# EAGLE design rpi_can (EAGLE 6.6.0)
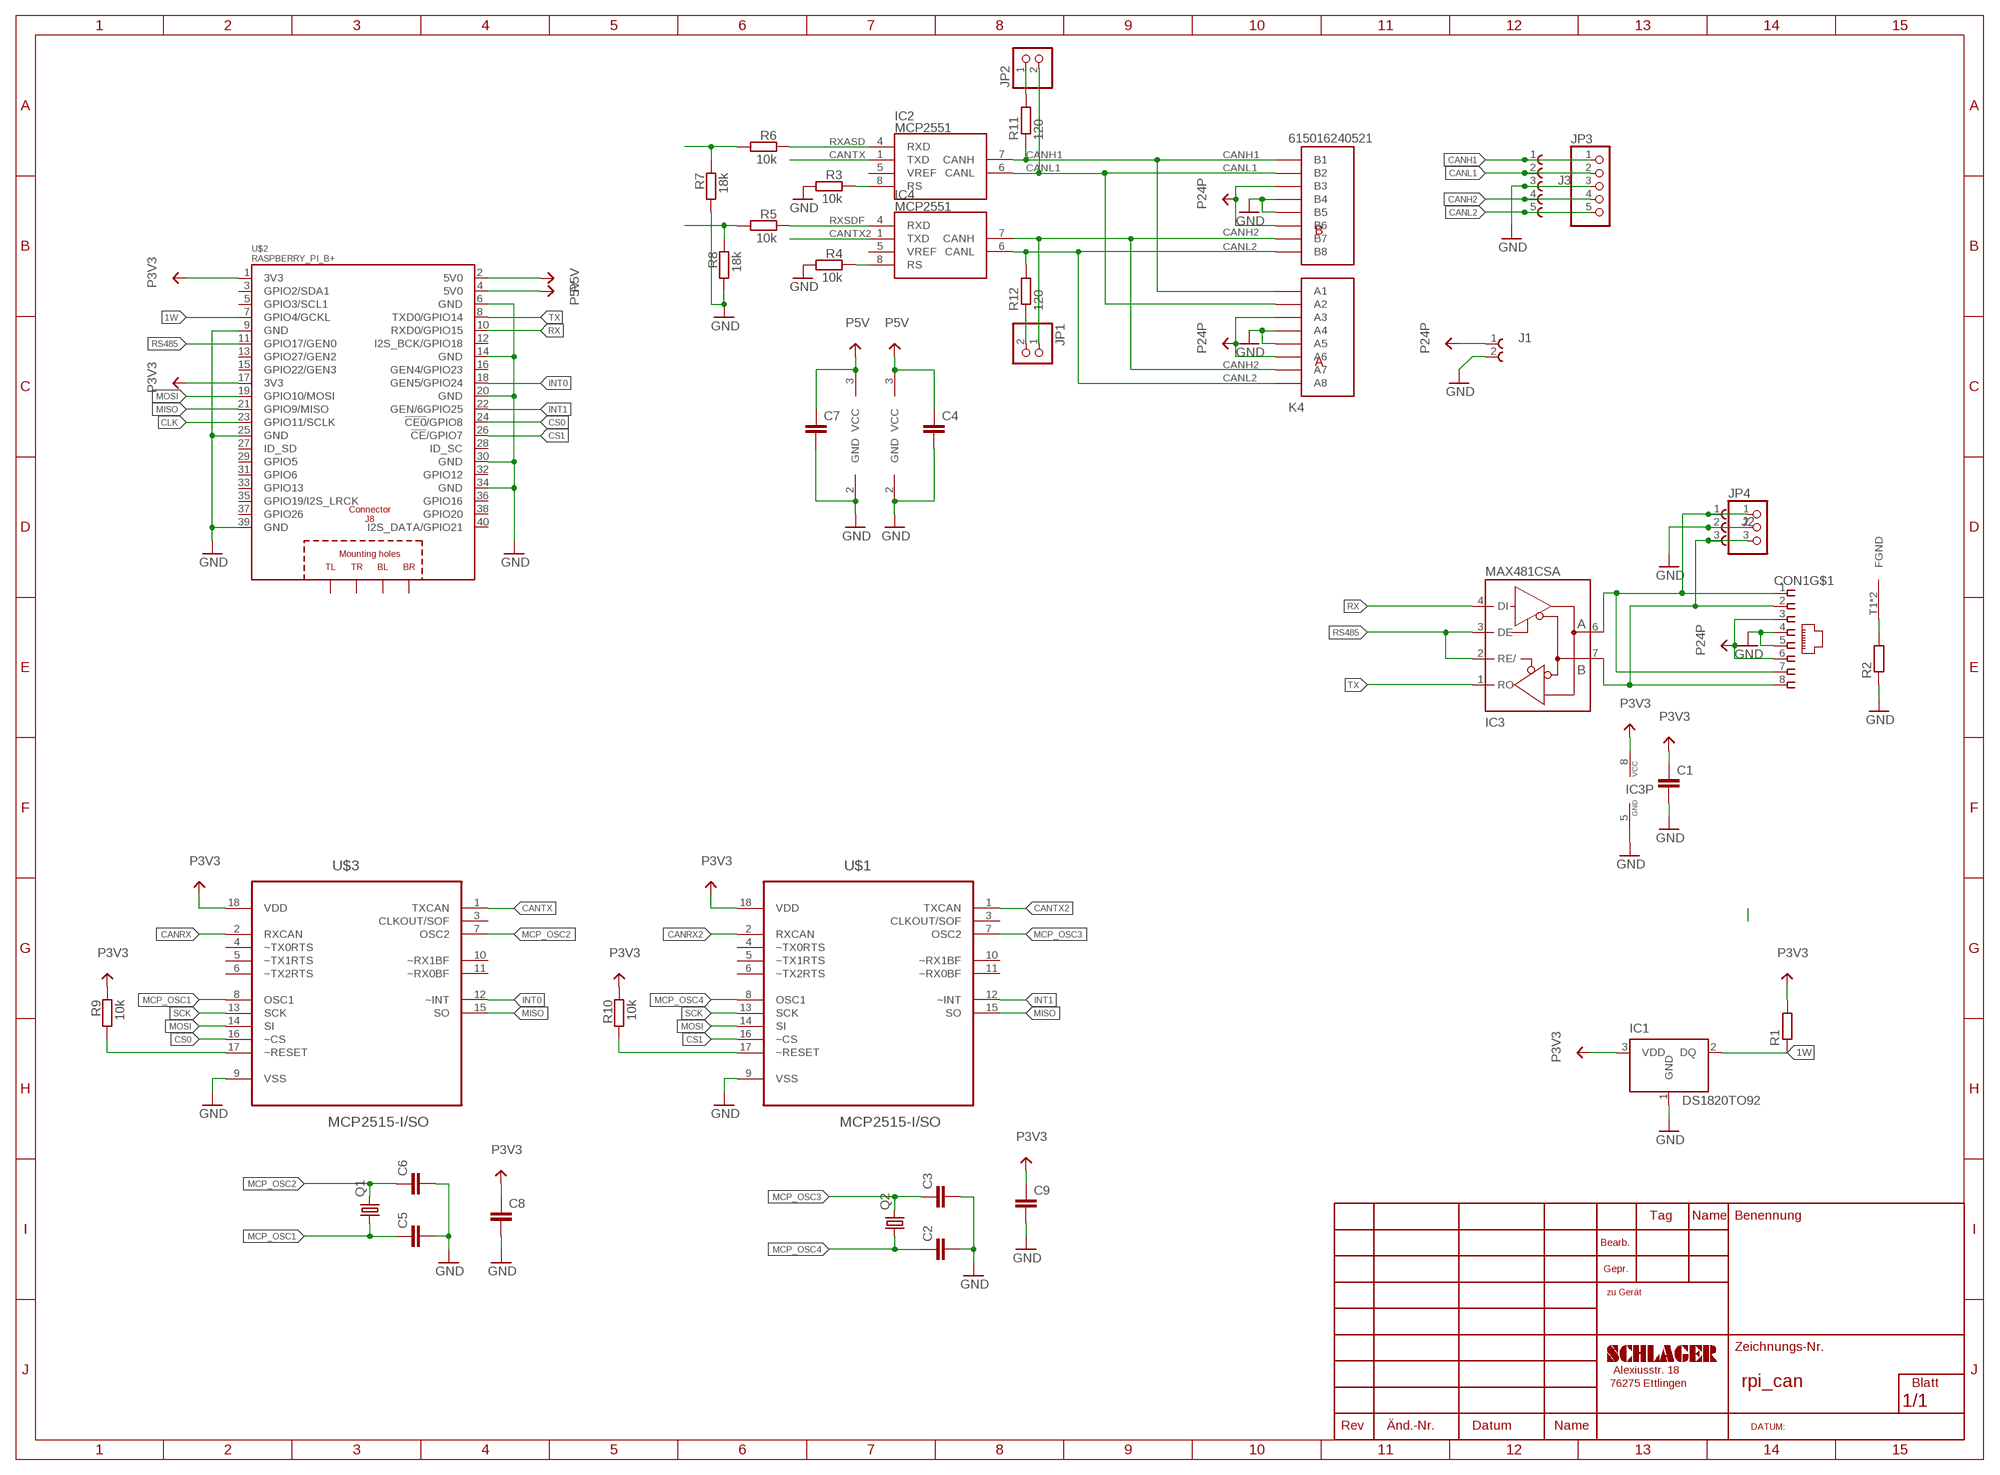
[diagram p0: schematic, sheet 1]

## Parts
C1  C-EUC0805  [C0805]
C2  C-EUC0805  [C0805]
C3  C-EUC0805  [C0805]
C4  C-EUC0805  [C0805]
C5  C-EUC0805  [C0805]
C6  C-EUC0805  [C0805]
C7  C-EUC0805  [C0805]
C8  C-EUC0805  [C0805]
C9  C-EUC0805  [C0805]
CON1  MEBP_8-8G  [MEBP]
IC1  DS1820TO92  [TO-92]
IC2  MCP2551  [SO-8]
IC3  MAX481CSA  [SO08]
IC4  MCP2551  [SO-8]
J1  691322310002  [691322310002]
J2  691322310003  [691322310003]
J3  691322310005  [691322310005]
JP1  PINHD-1X2  [1X02]
JP2  PINHD-1X2  [1X02]
JP3  PINHD-1X5  [1X05]
JP4  PINHD-1X3  [1X03]
K4  615016240521  [615016240521]
Q1  CRYSTALHC49S  [HC49/S]
Q2  CRYSTALHC49S  [HC49/S]
R1  R-EU_R0805  [R0805]
R2  R-EU_R0805  [R0805]
R3  10k  R-EU_R0805  [R0805]
R4  10k  R-EU_R0805  [R0805]
R5  10k  R-EU_R0805  [R0805]
R6  10k  R-EU_R0805  [R0805]
R7  18k  R-EU_R0805  [R0805]
R8  18k  R-EU_R0805  [R0805]
R9  10k  R-EU_R0805  [R0805]
R10  10k  R-EU_R0805  [R0805]
R11  120  R-EU_R0805  [R0805]
R12  120  R-EU_R0805  [R0805]
U$1  MCP2515-I/SO  [SOIC127P1034X264-18N]
U$2  RASPBERRY_PI_B+  [RASPBERRY_PI_B+]
U$3  MCP2515-I/SO  [SOIC127P1034X264-18N]

## Nets
1W: IC1.2(DQ) R1.1 U$2.7(GPIO4/GCKL)
CANH1: IC2.7(CANH) J3.1 JP3.1 K4.A1 K4.B1 R11.1
CANH2: IC4.7(CANH) J3.4 JP1.1 JP3.4 K4.A7 K4.B7
CANL1: IC2.6(CANL) J3.2 JP2.2 JP3.2 K4.A2 K4.B2
CANL2: IC4.6(CANL) J3.5 JP3.5 K4.A8 K4.B8 R12.2
CANRX: R6.2 R7.1 U$3.2(RXCAN)
CANRX2: R5.2 R8.1 U$1.2(RXCAN)
CANTX: IC2.1(TXD) U$3.1(TXCAN)
CANTX2: IC4.1(TXD) U$1.1(TXCAN)
CLK: U$2.23(GPIO11/SCLK)
CS0: U$2.24(!CE0!/GPIO8) U$3.16(~CS)
CS1: U$1.16(~CS) U$2.26(!CE!/GPIO7)
GND: C1.2 C2.2 C3.2 C4.2 C5.2 C6.2 C7.2 C8.2 C9.2 CON1.4 CON1.5 IC1.1(GND) IC2.2(GND) IC3.5(GND) IC4.2(GND) J1.2 J2.2 J3.3 JP3.3 JP4.2 K4.A4 K4.A5 K4.B4 K4.B5 R2.1 R3.2 R4.2 R7.2 R8.2 U$1.9(VSS) U$2.6(GND) U$2.9(GND) U$2.14(GND) U$2.20(GND) U$2.25(GND) U$2.30(GND) U$2.34(GND) U$2.39(GND) U$3.9(VSS)
INT0: U$2.18(GEN5/GPIO24) U$3.12(~INT)
INT1: U$1.12(~INT) U$2.22(GEN/6GPIO25)
MCP_OSC1: C5.1 Q1.1 U$3.8(OSC1)
MCP_OSC2: C6.1 Q1.2 U$3.7(OSC2)
MCP_OSC3: C3.1 Q2.2 U$1.7(OSC2)
MCP_OSC4: C2.1 Q2.1 U$1.8(OSC1)
MISO: U$1.15(SO) U$2.21(GPIO9/MISO) U$3.15(SO)
MOSI: U$1.14(SI) U$2.19(GPIO10/MOSI) U$3.14(SI)
N$1: R10.2 U$1.17(~RESET)
N$2: IC2.8(RS) R3.1
N$3: CON1.T1(FGND) CON1.T2(FGND) R2.2
N$4: IC4.8(RS) R4.1
N$5: R9.2 U$3.17(~RESET)
N$6: JP2.1 R11.2
N$7: JP1.2 R12.1
P3V3: C1.1 C8.1 C9.1 IC1.3(VDD) IC3.8(VCC) R1.2 R9.1 R10.1 U$1.18(VDD) U$2.1(3V3) U$2.17(3V3) U$3.18(VDD)
P5V: C4.1 C7.1 IC2.3(VCC) IC4.3(VCC) U$2.2(5V0) U$2.4(5V0)
P24P: CON1.3 CON1.6 J1.1 K4.A3 K4.A6 K4.B3 K4.B6
RS485: IC3.2(RE/) IC3.3(DE) U$2.11(GPIO17/GEN0)
RS485_A: CON1.1 CON1.7 IC3.6(A) J2.1 JP4.1
RS485_B: CON1.2 CON1.8 IC3.7(B) J2.3 JP4.3
RX: IC3.4(DI) U$2.10(RXD0/GPIO15)
RXASD: IC2.4(RXD) R6.1
RXSDF: IC4.4(RXD) R5.1
SCK: U$1.13(SCK) U$3.13(SCK)
TX: IC3.1(RO) U$2.8(TXD0/GPIO14)
Unconnected: IC2.5(VREF) IC4.5(VREF) U$1.3(CLKOUT/SOF) U$1.4(~TX0RTS) U$1.5(~TX1RTS) U$1.6(~TX2RTS) U$1.10(~RX1BF) U$1.11(~RX0BF) U$2.3(GPIO2/SDA1) U$2.5(GPIO3/SCL1) U$2.12(I2S_BCK/GPIO18) U$2.13(GPIO27/GEN2) U$2.15(GPIO22/GEN3) U$2.16(GEN4/GPIO23) U$2.27(ID_SD) U$2.28(ID_SC) U$2.29(GPIO5) U$2.31(GPIO6) U$2.32(GPIO12) U$2.33(GPIO13) U$2.35(GPIO19/I2S_LRCK) U$2.36(GPIO16) U$2.37(GPIO26) U$2.38(GPIO20) U$2.40(I2S_DATA/GPIO21) U$2.PE_BL(BL) U$2.PE_BR(BR) U$2.PE_TL(TL) U$2.PE_TR(TR) U$3.3(CLKOUT/SOF) U$3.4(~TX0RTS) U$3.5(~TX1RTS) U$3.6(~TX2RTS) U$3.10(~RX1BF) U$3.11(~RX0BF)

## Library data of the parts
C1-C9 = schlager_passiv:C-EU: CAPACITOR, European symbol
CON1 = myconn:MEBP_8-8G: Reichelt RJ45 geschirmt MEBP 8-8G
IC1 = schlager_ics:DS1820: DS1820 - 1-Wire Digital Thermometer
IC2 IC4 = MYMCHIP:MCP2551: CAN Transceiver
IC3 = maxim:MAX481CSA: RS485 TRANSEIVER; MF: MAXIM; MPN: MAX481CSA; OC_FARNELL: unknown; OC_NEWARK: 90C3817
J1 = Eagle_TERMINAL_BLOCKS_rev16a:691322310002: WR-TBL Serie 322 - 3.81mm Vertical PCB Header , 2 Pins=>Code : Con_TBL_Pluggable_3.81_PCB_THT_Simple_691322310002 <http://katalog.we-online.de/media/images/eican/Con_TBL_Pluggable_3.81_PCB_THT_Simple_6913223100xx_pf2.jpg> Details see: http://katalog.we-online.de/en/em/691_322_310_0xx Created 2014-06-19, Karrer Zheng 2014 (C) Würth Elektronik
J2 = Wuerth_TERMINAL_BLOCKS_rev16a:691322310003: WR-TBL Serie 322 - 3.81mm Vertical PCB Header , 3 Pins=>Code : Con_TBL_Pluggable_3.81_PCB_THT_Simple_691322310003 <http://katalog.we-online.de/media/images/eican/Con_TBL_Pluggable_3.81_PCB_THT_Simple_6913223100xx_pf2.jpg> Details see: http://katalog.we-online.de/en/em/691_322_310_0xx Created 2014-06-19, Karrer Zheng 2014 (C) Würth Elektronik
J3 = Eagle_TERMINAL_BLOCKS_rev16a:691322310005: WR-TBL Serie 322 - 3.81mm Vertical PCB Header , 5 Pins=>Code : Con_TBL_Pluggable_3.81_PCB_THT_Simple_691322310005 <http://katalog.we-online.de/media/images/eican/Con_TBL_Pluggable_3.81_PCB_THT_Simple_6913223100xx_pf2.jpg> Details see: http://katalog.we-online.de/en/em/691_322_310_0xx Created 2014-06-19, Karrer Zheng 2014 (C) Würth Elektronik
JP1 JP2 = pinhead:PINHD-1X2: PIN HEADER
JP3 = pinhead:PINHD-1X5: PIN HEADER
JP4 = pinhead:PINHD-1X3: PIN HEADER
K4 = Wuerth_Elektronik_eiCan_Communication_Connectors:615016240521: WR-MJ Horizontal Shielded Dual Stacked Port with EMI Panel Finger 8P8C Modular Jack Tab Up & Down, 16 Pins
Q1 Q2 = crystal:CRYSTAL: CRYSTAL; OC_FARNELL: 1667008; OC_NEWARK: unknown
R1-R12 = schlager_passiv:R-EU_: RESISTOR, European symbol
U$1 U$3 = schlager_ics:MCP2515-I/SO: CAN Controller; MPN: MCP2515-I/SO; OC_FARNELL: 1292239; OC_NEWARK: 29H7136; PACKAGE: SOIC-18; SUPPLIER: Microchip
U$2 = debauer_modules:RASPBERRY_PI_B+

## Net classes
4 USBpair: width 0.254 mm, drill 0.406 mm, clearance 0.508 mm

## Board
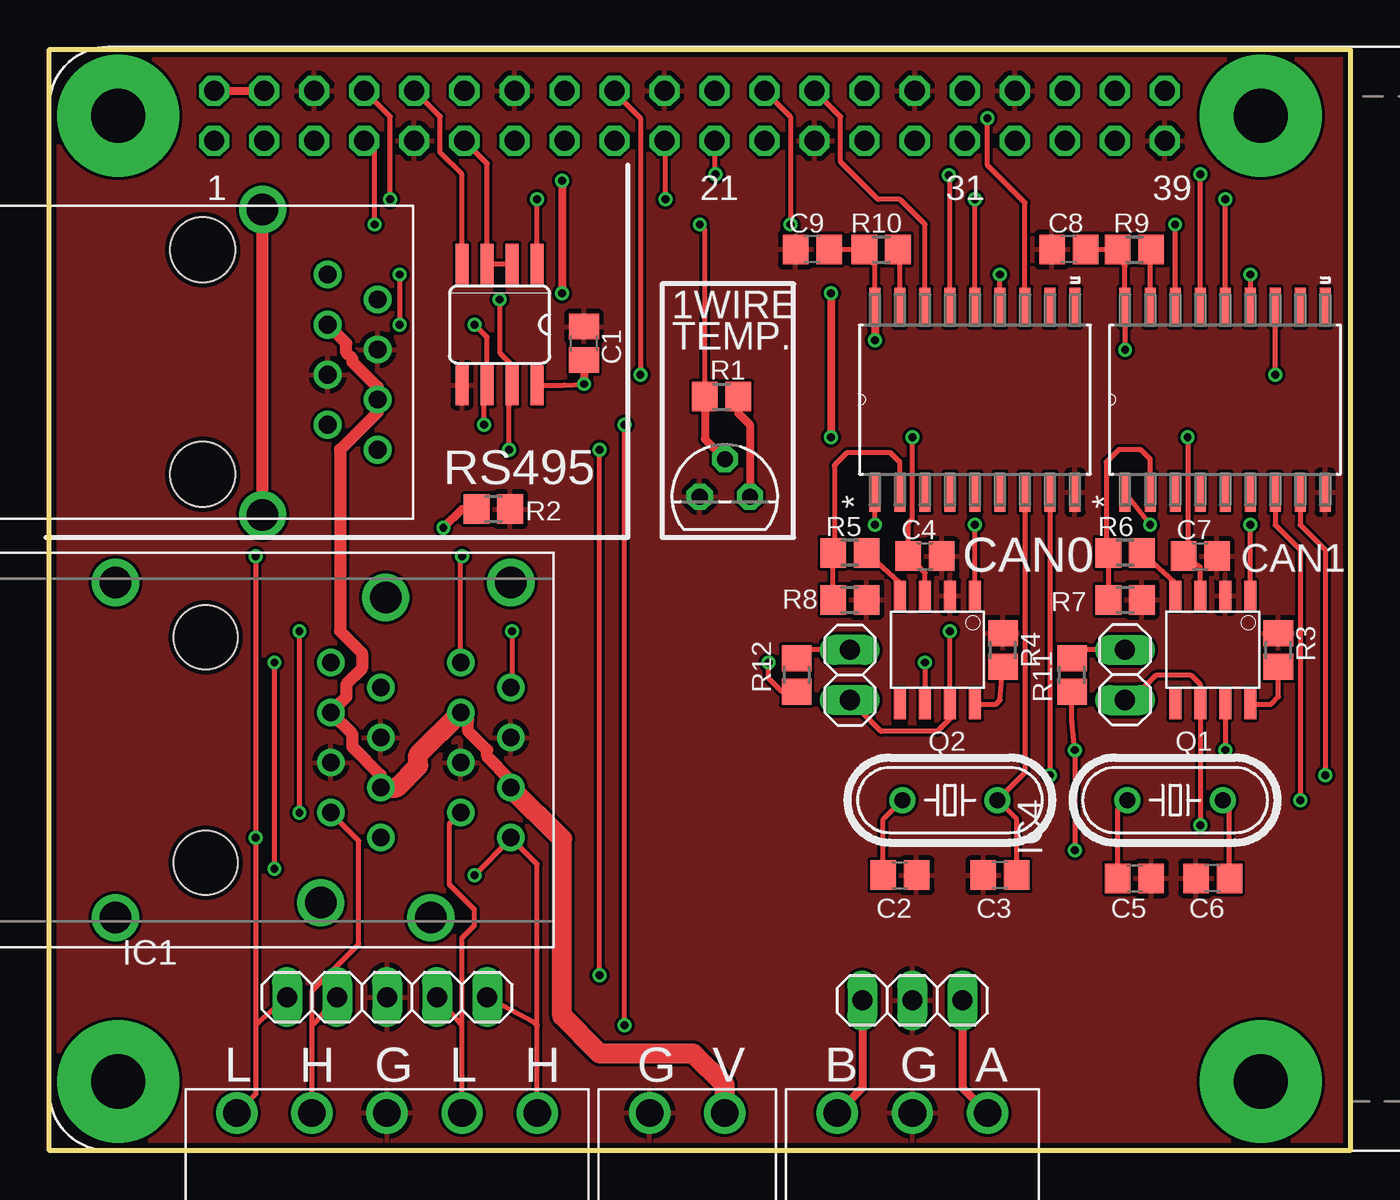
[diagram p1: board, top side]
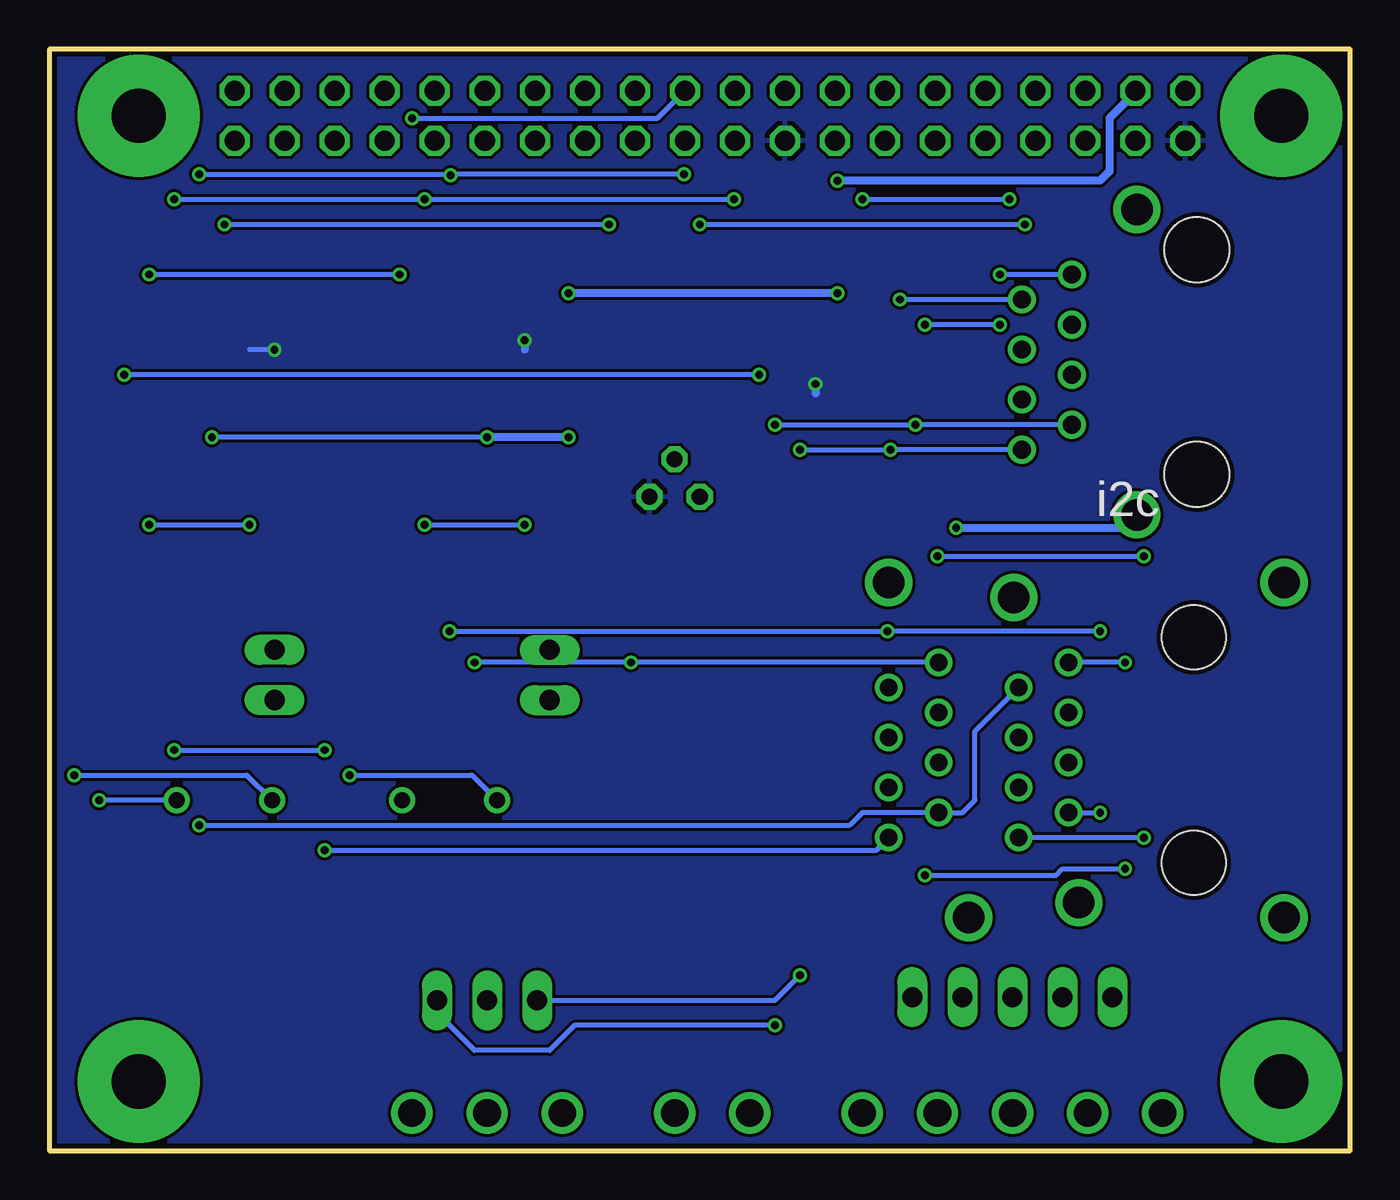
[diagram p2: board, bottom side, seen from below]

Size 66.04 x 55.88 mm. Coordinates in mm from the lower left corner, seen from the top.
Outline: 0,0 0,55.88 66.04,55.88 66.04,0 0,0
Copper layers (1*16): Top 0.035mm / dielectric 1.5mm / Bottom 0.035mm
Design rules "ITEADstudio_DRC": minimum track width 6mil, minimum drill 12mil, track to track 6mil, track to pad 6mil, pad to pad 6mil, via to via 6mil, smd to smd 0mil, copper to edge 10mil, drill to drill 10mil, minimum pad ring 10mil, minimum via ring 6mil, stop-mask expansion 2mil, vias tented up to drill 100mil, thermal gap 10mil

### Footprints (pad centres in the part's own frame; a part is rotated, then mirrored left to right if it is on the bottom)
C0805 = smd 1.3 x 1.5: 1 -0.85,0; 2 0.85,0
MEBP = drill 0.9: 1 -4.445,6.35; 2 -3.175,8.89; 3 -1.9,6.35; 4 -0.635,8.89; 5 0.635,6.35; 6 1.9,8.89; 7 3.175,6.35; 8 4.445,8.89 | drill 1.6: T1 -7.75,3.05; T2 7.75,3.05 | hole 3.3: -5.7,0; 5.7,0
TO-92 = drill 0.813 pad 1.27 octagon: 1 -1.27,0; 2 0,1.905; 3 1.27,0
SO-8 = smd 0.61 x 1.524: 1 0,-0.203; 2 1.27,-0.203; 3 2.54,-0.203; 4 3.81,-0.203; 5 3.81,5.283; 6 2.54,5.283; 7 1.27,5.283; 8 0,5.283
SO08 = smd 0.66 x 2.032: 1 -1.905,-3.073; 2 -0.635,-3.073; 3 0.635,-3.073; 4 1.905,-3.073; 5 1.905,3.073; 6 0.635,3.073; 7 -0.635,3.073; 8 -1.905,3.073
691322310002 = drill 1.4: 1 -3.81,0; 2 0,0
691322310003 = drill 1.4: 1 -3.81,0; 2 0,0; 3 3.81,0
691322310005 = drill 1.4: 1 -3.81,0; 2 0,0; 3 3.81,0; 4 7.62,0; 5 11.43,0
1X02 = drill 1.016 long: 1 -1.27,0; 2 1.27,0
1X05 = drill 1.016 long: 1 -5.08,0; 2 -2.54,0; 3 0,0; 4 2.54,0; 5 5.08,0
1X03 = drill 1.016 long: 1 -2.54,0; 2 0,0; 3 2.54,0
615016240521 = drill 0.89: A1 -4.445,-1.27; A2 -3.175,1.27; A3 -1.905,-1.27; A4 -0.635,1.27; A5 0.635,-1.27; A6 1.905,1.27; A7 3.175,-1.27; A8 4.445,1.27; B1 4.445,7.87; B2 3.175,5.33; B3 1.905,7.87; B4 0.635,5.33; B5 -0.635,7.87; B6 -1.905,5.33; B7 -3.175,7.87; B8 -4.445,5.33 | drill 1.6: Z1 -8.505,-12.19; Z2 8.505,-12.19; Z3 7.745,-1.78; Z4 -7.745,1.52; Z5 8.505,3.81; Z6 -8.505,7.87 | hole 3.25: -5.715,-7.62; 5.715,-7.62
HC49/S = drill 0.813: 1 -2.413,0; 2 2.413,0
R0805 = smd 1.3 x 1.5: 1 -0.85,0; 2 0.85,0
SOIC127P1034X264-18N = smd 1.981 x 0.559: 1 -4.699,5.08; 2 -4.699,3.81; 3 -4.699,2.54; 4 -4.699,1.27; 5 -4.699,0; 6 -4.699,-1.27; 7 -4.699,-2.54; 8 -4.699,-3.81; 9 -4.699,-5.08; 10 4.699,-5.08; 11 4.699,-3.81; 12 4.699,-2.54; 13 4.699,-1.27; 14 4.699,0; 15 4.699,1.27; 16 4.699,2.54; 17 4.699,3.81; 18 4.699,5.08
RASPBERRY_PI_B+ = drill 1.016 octagon: 1 8.37,51.23; 2 8.37,53.77; 3 10.91,51.23; 4 10.91,53.77; 5 13.45,51.23; 6 13.45,53.77; 7 15.99,51.23; 8 15.99,53.77; 9 18.53,51.23; 10 18.53,53.77; 11 21.07,51.23; 12 21.07,53.77; 13 23.61,51.23; 14 23.61,53.77; 15 26.15,51.23; 16 26.15,53.77; 17 28.69,51.23; 18 28.69,53.77; 19 31.23,51.23; 20 31.23,53.77; 21 33.77,51.23; 22 33.77,53.77; 23 36.31,51.23; 24 36.31,53.77; 25 38.85,51.23; 26 38.85,53.77; 27 41.39,51.23; 28 41.39,53.77; 29 43.93,51.23; 30 43.93,53.77; 31 46.47,51.23; 32 46.47,53.77; 33 49.01,51.23; 34 49.01,53.77; 35 51.55,51.23; 36 51.55,53.77; 37 54.09,51.23; 38 54.09,53.77; 39 56.63,51.23; 40 56.63,53.77 | drill 2.75 pad 6.2: PE_BL 3.5,3.5; PE_BR 61.5,3.5; PE_TL 3.5,52.5; PE_TR 61.5,52.5

### Placement (x,y rotation side)
C1  27.15,40.96 90 top
C2  43.18,13.97 0 top
C3  48.26,13.97 180 top
C4  44.45,30.16 0 top
C5  55.09,13.81 0 top
C6  59.05,13.81 180 top
C7  58.42,30.16 0 top
C8  51.75,45.72 180 top
C9  38.73,45.72 180 top
CON1  7.78,40.01 270 top
IC1  34.29,33.18 0 top
IC2  60.96,27.94 180 top
IC3  22.86,41.91 180 top
IC4  46.99,27.94 180 top
J1  30.48,1.91 180 top
J2  43.81,1.91 180 top
J3  20.95,1.91 180 top
JP1  40.64,24.13 90 top
JP2  54.61,24.13 270 top
JP3  17.14,7.78 180 top
JP4  43.81,7.62 180 top
K4  15.56,20.32 270 top
Q1  57.15,17.78 0 top
Q2  45.72,17.78 0 top
R1  34.13,38.26 0 top
R2  22.54,32.54 180 top
R3  62.39,25.4 90 top
R4  48.42,25.4 90 top
R5  40.64,30.32 180 top
R6  54.61,30.32 180 top
R7  54.61,27.94 0 top
R8  40.64,27.94 0 top
R9  55.09,45.72 0 top
R10  42.23,45.72 0 top
R11  51.91,24.13 90 top
R12  37.94,24.13 270 top
U$1  46.99,38.1 90 top
U$2  0,0 0 top
U$3  59.69,38.1 90 top

### Tracks (layer width: path | path; a pad name or v marks a point on that pad's centre or on a via)
1W  (via drill 0.4)
  Top 0.254: R1.1 33.28,46.73 v33.02,46.99 | v16.51,46.99 16.51,50.71 U$2.7
  Top 0.406: R1.1 33.28,36.09 IC1.2
  Bottom 0.254: v33.02,46.99 v16.51,46.99
CANH1  (via drill 0.4)
  Top 0.254: v21.59,13.97 23.43,15.81 K4.B1 24.77,14.54 24.77,6.35 | v11.43,14.29 v11.43,24.77 | IC2.7 v59.69,20.32 | v52.07,15.24 v52.07,20.32 51.91,21.75 R11.1 | J3.1 24.77,6.35 | JP3.1 24.61,6.51 24.77,6.35
  Bottom 0.254: v21.59,13.97 14.92,13.97 14.61,14.29 v11.43,14.29 | v11.43,24.77 K4.A1 | v59.69,20.32 v52.07,20.32 | v52.07,15.24 24.06,15.24 K4.B1
CANH2  (via drill 0.4)
  Top 0.254: v12.7,17.14 v12.7,26.35 | v23.5,26.35 23.5,23.56 K4.B7 | v45.72,26.35 IC4.7 45.72,21.91 45.09,21.27 42.23,21.27 JP1.1 | J3.4 13.34,6.35 | 13.34,6.35 13.34,8.1 15.72,10.48 15.72,15.72 K4.A7 | JP3.4 13.49,6.51 13.34,6.35
  Bottom 0.254: K4.A7 v12.7,17.14 | v12.7,26.35 v23.5,26.35 v45.72,26.35
CANL1  (via drill 0.4)
  Top 0.254: v58.42,16.51 IC2.6 58.42,23.65 57.94,24.13 56.2,24.13 54.93,22.86 JP2.2 | J3.2 20.95,6.35 | 20.95,6.35 20.95,10.79 21.59,11.43 21.59,12.22 20.32,13.49 20.32,16.58 K4.B2 | JP3.2 20.8,6.51 20.95,6.35
  Bottom 0.254: K4.A2 19.05,21.27 19.05,17.78 19.68,17.14 K4.B2 24.77,17.14 25.4,16.51 v58.42,16.51
CANL2  (via drill 0.4)
  Top 0.254: K4.B8 20.89,30.09 v20.95,30.16 | v10.48,30.16 v10.48,15.88 10.48,6.35 | v44.45,24.77 IC4.6 | 10.48,6.35 10.48,2.86 J3.5 | JP3.5 10.64,6.51 10.48,6.35 | R12.2 37.2,23.28 36.51,23.97 v36.51,24.77
  Bottom 0.254: v20.95,30.16 v10.48,30.16 | v10.48,15.88 K4.A8 | K4.B8 v36.51,24.77 v44.45,24.77
CANRX
  Top 0.254: U$3.2 55.88,35.08 55.4,35.56 54.29,35.56 53.66,34.92 53.66,30.58 R6.2 R7.1
CANRX2
  Top 0.254: R8.1 R5.2 39.85,30.54 39.85,34.77 40.48,35.4 42.7,35.4 43.18,34.92 U$1.2
CANTX  (via drill 0.4)
  Top 0.254: IC2.1 v60.96,31.75 | v55.88,31.75 U$3.1
  Bottom 0.254: v60.96,31.75 v55.88,31.75
CANTX2  (via drill 0.4)
  Top 0.254: IC4.1 v46.99,31.75 | v41.91,31.75 U$1.1
  Bottom 0.254: v46.99,31.75 v41.91,31.75
CS0  (via drill 0.4)
  Top 0.254: U$3.16 v57.15,46.99 | U$2.24 37.62,52.46 v37.62,46.99
  Bottom 0.254: v57.15,46.99 v37.62,46.99
CS1
  Top 0.254: U$1.16 44.45,46.99 43.18,48.26 42.07,48.26 40.16,50.16 40.16,52.46 U$2.26
GND
  pour Top: -3.81,60.96 95.25,60.96 95.25,-3.81 -3.81,-3.81
INT0  (via drill 0.4)
  Top 0.254: U$2.18 28.69,53.7 30,52.39 v30,39.37 | v62.23,39.37 U$3.12
  Bottom 0.254: v30,39.37 v62.23,39.37
INT1  (via drill 0.4)
  Top 0.254: U$1.12 49.53,48.1 47.62,50.01 v47.62,52.39
  Bottom 0.254: v47.62,52.39 35.15,52.39 U$2.22
MCP_OSC1  (via drill 0.4)
  Top 0.254: C5.1 54.24,17.28 Q1.1 | U$3.8 63.5,31.75 64.77,30.48 v64.77,19.05
  Bottom 0.254: v64.77,19.05 56.01,19.05 Q1.1
MCP_OSC2  (via drill 0.4)
  Top 0.254: C6.1 59.91,17.44 Q1.2 | U$3.7 62.23,31.75 63.5,30.48 v63.5,17.78
  Bottom 0.254: Q1.2 v63.5,17.78
MCP_OSC3
  Top 0.254: C3.1 49.11,16.8 Q2.2 49.53,19.18 U$1.7
MCP_OSC4  (via drill 0.4)
  Top 0.254: C2.1 42.33,16.8 Q2.1 | U$1.8 v50.8,19.05
  Bottom 0.254: v50.8,19.05 44.58,19.05 Q2.1
MISO  (via drill 0.4)
  Top 0.254: U$1.15 45.72,49.44 v45.67,49.48 | U$3.15 v58.42,49.53 | U$2.21 33.77,49.57 v33.81,49.53
  Bottom 0.254: v58.42,49.53 45.72,49.53 v45.67,49.48 45.63,49.53 v33.81,49.53
MOSI  (via drill 0.4)
  Top 0.254: U$1.14 v46.99,48.26 | U$3.14 v59.69,48.26 | v31.27,48.26 31.27,51.19 U$2.19
  Bottom 0.254: v31.27,48.26 v46.99,48.26 v59.69,48.26
N$1
  Top 0.254: U$1.17 43.18,45.3 R10.2
N$2
  Top 0.254: IC2.8 62.03,22.66 62.39,23.02 R3.1
N$3  (via drill 0.4)
  Top 0.406: R2.2 20.95,32.54 v20,31.59
  Top 0.61: CON1.T2 CON1.T1
  Bottom 0.406: v20,31.59 11.49,31.59 CON1.T2
N$4
  Top 0.254: IC4.8 48.06,22.66 48.26,22.86 R4.1
N$5
  Top 0.254: U$3.17 55.88,45.3 R9.2
N$6
  Top 0.254: JP2.1 52.33,25.4 R11.2
N$7
  Top 0.254: JP1.2 38.36,25.4 R12.1
P3V3  (via drill 0.4)
  Top 0.254: v54.61,40.64 U$3.18 54.61,44.87 R9.1 C8.1 | IC3.8 26.14,38.84 v27.15,38.89 | U$1.18 41.91,44.87 R10.1 C9.1
  Top 0.406: C1.1 v27.15,38.89 | U$1.18 v41.91,41.12 | R1.2 34.98,37.41 35.56,36.83 IC1.3
  Bottom 0.254: v54.61,40.64 55.88,40.64
  Bottom 0.406: v27.15,38.89 27.15,38.42 | v41.91,41.12 41.91,40.64
  pour Bottom: -8.89,64.77 102.87,64.77 102.87,-10.16 -8.89,-10.16
P5V  (via drill 0.4)
  Top 0.254: IC4.3 44.45,29.31 C4.1 43.6,31.85 43.81,32.07 v43.81,36.2 | IC2.3 58.42,29.63 C7.1 57.78,30.7 v57.78,36.2
  Top 0.406: U$2.2 U$2.4 | v26.04,49.21 v26.04,43.5 | v39.69,43.5 v39.69,36.2
  Bottom 0.254: v43.81,36.2 v57.78,36.2
  Bottom 0.406: U$2.4 10.91,53.7 12.22,52.39 12.22,49.69 12.7,49.21 v26.04,49.21 | v26.04,43.5 v39.69,43.5 | v39.69,36.2 v43.81,36.2
P24P
  Top 0.61: K4.A6 16.83,19.05 15.4,20.48 15.4,21.11 K4.A3 15.08,23.02 15.08,23.65 15.88,24.45 15.88,25.24 14.76,26.35 14.76,35.56 16.67,37.47 CON1.6 16.67,38.73 15.4,40.01 15.4,40.16 15.08,40.48 15.08,40.95 CON1.3 | K4.B3 23.43,18.8 22.23,20 22.23,20.32 21.27,21.27 21.27,21.84 K4.B6
  Top 1.016: K4.A6 17.62,18.41 18.73,19.53 18.73,20.07 K4.B6 | J1.1 34.29,3.33 32.7,4.92 27.94,4.92 26.04,6.83 26.04,15.81 K4.B3
RS485
  Top 0.254: U$2.11 22.23,50.08 IC3.3 IC3.2
RS485_A  (via drill 0.4)
  Top 0.254: v22.07,36.83 22.07,38.68 IC3.6 22.23,41.27 v21.59,41.91 | v17.78,44.45 v17.78,41.91 | v29.21,6.35 v29.21,36.83
  Top 0.406: JP4.1 46.35,3.17 J2.1
  Bottom 0.254: CON1.7 v22.07,36.83 v29.21,36.83 | CON1.1 v17.78,44.45 | v17.78,41.91 v21.59,41.91 | JP4.1 46.35,6.99 44.45,5.08 40.64,5.08 39.37,6.35 v29.21,6.35
RS485_B  (via drill 0.4)
  Top 0.254: v22.86,43.18 22.86,40.48 23.5,39.85 IC3.7 23.34,38.68 v23.34,35.56 | v27.94,8.89 v27.94,35.56
  Top 0.406: JP4.3 41.27,3.17 J2.3
  Bottom 0.254: CON1.2 v22.86,43.18 | CON1.8 v23.34,35.56 v27.94,35.56 | JP4.3 29.21,7.62 v27.94,8.89
RX
  Top 0.254: IC3.4 20.95,49.53 19.84,50.64 19.84,52.46 U$2.10
RXASD
  Top 0.254: IC2.4 57.15,28.79 R6.1
RXSDF
  Top 0.254: IC4.4 43.18,28.79 R5.1
SCK  (via drill 0.4)
  Top 0.254: U$1.13 v48.26,44.45 | v60.96,44.45 U$3.13
  Bottom 0.254: v48.26,44.45 v60.96,44.45
TX  (via drill 0.4)
  Top 0.254: IC3.1 v24.77,48.26 | v17.3,48.26 17.3,52.46 U$2.8
  Bottom 0.254: v24.77,48.26 v17.3,48.26

### Text on the board
tNames: 1WIRE | TEMP. | RS495 | CAN0 | CAN1 | CAN HAT by debauer | www.debauer.net | FabLab KA | L | H | G | L | H | G | V | B | G | A
bNames: i2c | ESP8255-01